# Altium schematic sheet IO_Buffer.SchDoc: WR_Cute_Carrier
size A4; Author: G.Kasprowicz; CompanyName: WUT ISE; DrawnBy: G.Kasprowicz; Organization: WUT ISE; Address1: PW ISE; Address2: Nowowiejska 15/19 00-665 Warsaw; Address3: gkasprow@gmail.com; DocumentNumber: 6; Revision: 2; SheetNumber: 6; SheetTotal: 7; ModifiedBy: -; CheckedDate: -; Title2: IO_Buffer; DivGrp: WUT ISE; Designer: G.Kasprowicz; ModifiedDate: -; ProjectName: Sensor Box
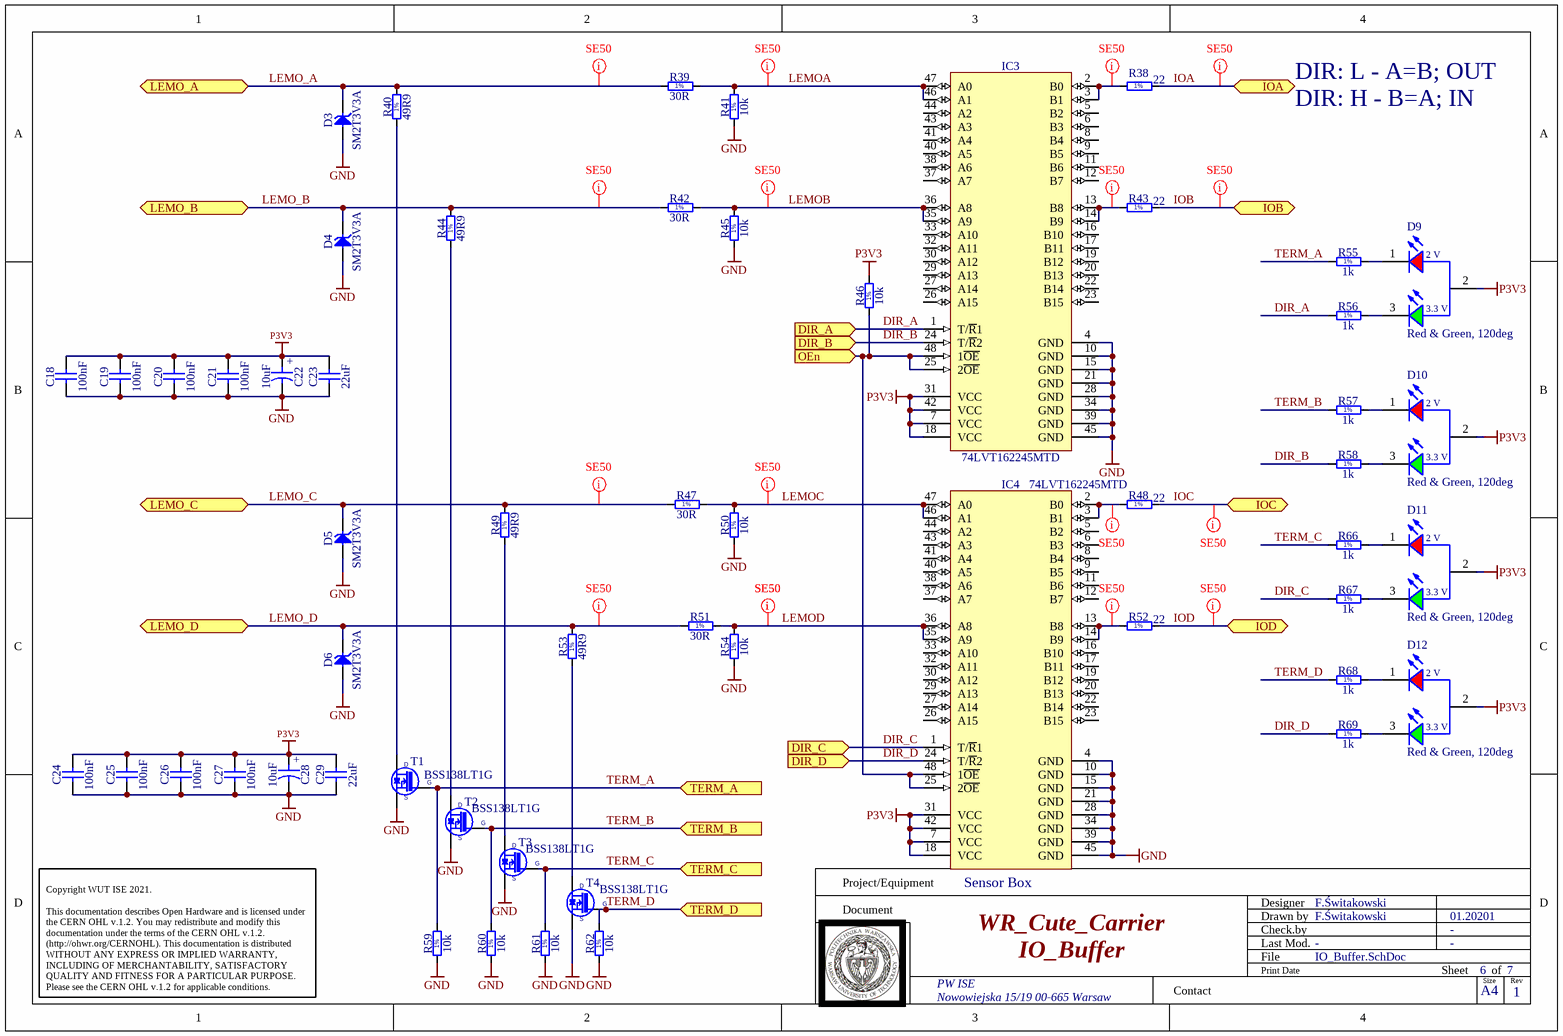
[diagram p0: IO_Buffer.SchDoc]

## Parts
C18  100nF  [CAPC1005X55N]
C19  100nF  [CAPC1005X55N]
C20  100nF  [CAPC1005X55N]
C21  100nF  [CAPC1005X55N]
C22  10uF  [CAPAE430X540N]
C23  22uF  [CAPC2012X135N]
C24  100nF  [CAPC1005X55N]
C25  100nF  [CAPC1005X55N]
C26  100nF  [CAPC1005X55N]
C27  100nF  [CAPC1005X55N]
C28  10uF  [CAPAE430X540N]
C29  22uF  [CAPC2012X135N]
D3  SM2T3V3A  [DO-216AA]
D4  SM2T3V3A  [DO-216AA]
D5  SM2T3V3A  [DO-216AA]
D6  SM2T3V3A  [DO-216AA]
D9  Red & Green, 120deg  [WL-SBSW_1204]
D10  Red & Green, 120deg  [WL-SBSW_1204]
D11  Red & Green, 120deg  [WL-SBSW_1204]
D12  Red & Green, 120deg  [WL-SBSW_1204]
IC3  74LVT162245MTD  [SOP50P810X120-48N]
IC4  74LVT162245MTD  [SOP50P810X120-48N]
R38  22  [RESC1005X40N]
R39  30R  [RESC3225X70N]
R40  49R9  [RESC3225X70N]
R41  10k  [RESC1005X40N]
R42  30R  [RESC3225X70N]
R43  22  [RESC1005X40N]
R44  49R9  [RESC3225X70N]
R45  10k  [RESC1005X40N]
R46  10k  [RESC1005X40N]
R47  30R  [RESC3225X70N]
R48  22  [RESC1005X40N]
R49  49R9  [RESC3225X70N]
R50  10k  [RESC1005X40N]
R51  30R  [RESC3225X70N]
R52  22  [RESC1005X40N]
R53  49R9  [RESC3225X70N]
R54  10k  [RESC1005X40N]
R55  1k  [RESC1005X40N]
R56  1k  [RESC1005X40N]
R57  1k  [RESC1005X40N]
R58  1k  [RESC1005X40N]
R59  10k  [RESC1005X40N]
R60  10k  [RESC1005X40N]
R61  10k  [RESC1005X40N]
R62  10k  [RESC1005X40N]
R66  1k  [RESC1005X40N]
R67  1k  [RESC1005X40N]
R68  1k  [RESC1005X40N]
R69  1k  [RESC1005X40N]
T1  BSS138LT1G  [SOT95P240X110-3N]
T2  BSS138LT1G  [SOT95P240X110-3N]
T3  BSS138LT1G  [SOT95P240X110-3N]
T4  BSS138LT1G  [SOT95P240X110-3N]

## Ports
DIR_A (in), DIR_B (in), DIR_C (in), DIR_D (in), IOA (bidir), IOB (bidir), IOC (bidir), IOD (bidir), LEMO_A (bidir), LEMO_B (bidir), LEMO_C (bidir), LEMO_D (bidir), OEn (in), TERM_A (in), TERM_B (in), TERM_C (in), TERM_D (in)

## Nets
GND: C18.1 C19.1 C20.1 C21.1 C22.2 C23.1 C24.1 C25.1 C26.1 C27.1 C28.2 C29.1 D3.2(A) D4.2(A) D5.2(A) D6.2(A) IC3.4(GND) IC3.10(GND) IC3.15(GND) IC3.21(GND) IC3.28(GND) IC3.34(GND) IC3.39(GND) IC3.45(GND) IC4.4(GND) IC4.10(GND) IC4.15(GND) IC4.21(GND) IC4.28(GND) IC4.34(GND) IC4.39(GND) IC4.45(GND) R41.1 R45.1 R50.1 R54.1 R59.1 R60.1 R61.1 R62.1 T1.2(S) T2.2(S) T3.2(S) T4.2(S)
P3V3: C18.2 C19.2 C20.2 C21.2 C22.1 C23.2 C24.2 C25.2 C26.2 C27.2 C28.1 C29.2 D9.2(A) D10.2(A) D11.2(A) D12.2(A) IC3.7(VCC) IC3.18(VCC) IC3.31(VCC) IC3.42(VCC) IC4.7(VCC) IC4.18(VCC) IC4.31(VCC) IC4.42(VCC) R46.2
DIR_A: IC3.1(T/~{R}1) R56.1 ; port DIR_A
DIR_B: IC3.24(T/~{R}2) R58.1 ; port DIR_B
DIR_C: IC4.1(T/~{R}1) R67.1 ; port DIR_C
DIR_D: IC4.24(T/~{R}2) R69.1 ; port DIR_D
IOA: R38.2 ; port IOA
IOB: R43.2 ; port IOB
IOC: R48.2 ; port IOC
IOD: R52.2 ; port IOD
LEMO_A: D3.1(C) R39.1 R40.2 ; port LEMO_A
LEMO_B: D4.1(C) R42.1 R44.2 ; port LEMO_B
LEMO_C: D5.1(C) R47.1 R49.2 ; port LEMO_C
LEMO_D: D6.1(C) R51.1 R53.2 ; port LEMO_D
LEMOA: IC3.46(A1) IC3.47(A0) R39.2 R41.2
LEMOB: IC3.35(A9) IC3.36(A8) R42.2 R45.2
LEMOC: IC4.46(A1) IC4.47(A0) R47.2 R50.2
LEMOD: IC4.35(A9) IC4.36(A8) R51.2 R54.2
OEn: IC3.25(2~{OE}) IC3.48(1~{OE}) IC4.25(2~{OE}) IC4.48(1~{OE}) R46.1 ; port OEn
TERM_A: R55.1 R59.2 T1.1(G) ; port TERM_A
TERM_B: R57.1 R60.2 T2.1(G) ; port TERM_B
TERM_C: R61.2 R66.1 T3.1(G) ; port TERM_C
TERM_D: R62.2 R68.1 T4.1(G) ; port TERM_D
NetD9_1: D9.1(K) R55.2
NetD9_3: D9.3(K) R56.2
NetD10_1: D10.1(K) R57.2
NetD10_3: D10.3(K) R58.2
NetD11_1: D11.1(K) R66.2
NetD11_3: D11.3(K) R67.2
NetD12_1: D12.1(K) R68.2
NetD12_3: D12.3(K) R69.2
NetIC3_2: IC3.2(B0) IC3.3(B1) R38.1
NetIC3_13: IC3.13(B8) IC3.14(B9) R43.1
NetIC4_2: IC4.2(B0) IC4.3(B1) R48.1
NetIC4_13: IC4.13(B8) IC4.14(B9) R52.1
NetR40_1: R40.1 T1.3(D)
NetR44_1: R44.1 T2.3(D)
NetR49_1: R49.1 T3.3(D)
NetR53_1: R53.1 T4.3(D)

Not connected (* = marked no-connect by the designer): IC3 5(B2) 6(B3) 8(B4) 9(B5) 11(B6) 12(B7) 16(B10) 17(B11) 19(B12) 20(B13) 22(B14) 23(B15) 26(A15) 27(A14) 29(A13) 30(A12) 32(A11) 33(A10) 37(A7) 38(A6) 40(A5) 41(A4) 43(A3) 44(A2); IC4 5(B2) 6(B3) 8(B4) 9(B5) 11(B6) 12(B7) 16(B10) 17(B11) 19(B12) 20(B13) 22(B14) 23(B15) 26(A15) 27(A14) 29(A13) 30(A12) 32(A11) 33(A10) 37(A7) 38(A6) 40(A5) 41(A4) 43(A3) 44(A2)

## Layout directives
net class SE50: IOA, IOB, IOC, IOD, LEMO_A, LEMO_B, LEMO_C, LEMO_D, LEMOA, LEMOB, LEMOC, LEMOD, NetIC3_2, NetIC3_13, NetIC4_2, NetIC4_13

## Notes on the sheet
- DIR: L - A=B; OUT
- DIR: H - B=A; IN
- Project/Equipment
- Document
- Designer
- Drawn by
- Check.by
- F.Świtakowski
- 01.20201
- PW ISE
- Contact
- File
- Last Mod.
- Print Date
- Sheet
- Size
- A4
- of
- 1
- Rev
- Copyright WUT ISE 2021.
  This documentation describes Open Hardware and is licensed under the CERN OHL v.1.2. You may redistribute and modify this documentation under the terms of the CERN OHL v.1.2. (http://ohwr.org/CERNOHL). This documentation is distributed WITHOUT ANY EXPRESS OR IMPLIED WARRANTY, INCLUDING OF MERCHANTABILITY, SATISFACTORY QUALITY AND FITNESS FOR A PARTICULAR PURPOSE. Please see the CERN OHL v.1.2 for applicable conditions.
- Nowowiejska 15/19 00-665 Warsaw
- (in symbol 155124RG73200) 2 V; 3.3 V
- (in symbol CAE430-540_10UF_16V_20%) +
- (in symbol R0402_1K_1%_0.0625W_100PPM) 1%
- (in symbol R0402_10K_1%_0.0625W_100PPM) 1%
- (in symbol R0402_22R_1%_0.0625W_100PPM) 1%
- (in symbol R1210_30R_5%_0.5W_200PPM) 1%
- (in symbol R1210_49R9_1%_0.5W_100PPM_VISHAY_CRCW) 1%

## Library data of the parts
C18-C21 C24-C27 = CC0402_100NF_16V_10%_X5R: Non-polarised capacitor; Part Description: SMD Multilayer Chip Ceramic Capacitor; Manufacturer: GENERIC; Manufacturer1 Part Number: GRM155R61C104KA88D; Voltage: 16V; TC: X5R; Tolerance: ±10%; Part Number: CC0402_100NF_16V_10%_X5R; Component Kind: Standard; Component Type: Standard; Pin Count: 2; Value: 100nF; Status: None; Manufacturer Part Number: CC0402_100NF_16V_10%_X5R; Case: 0402; Mounted: Yes; Socket: No; SMD: Yes; Sense: No; Manufacturer1 Example: MURATA; Manufacturer1 ComponentHeight: 0.55mm; HelpURL: \\cern.ch\dfs\Applications\Altium\Datasheets\CC0402_X5R_MURATA_GRM.pdf; Author: CERN DEM JLC; CreateDate: 10.12.2013; LatestRevisionDate: 10.12.2013
C22 C28 = CAE430-540_10UF_16V_20%: Polarised capacitor; Part Description: Aluminum Electrolytic SMT Capacitor; Manufacturer: PANASONIC; Manufacturer Part Number: EEEFK1C100AR; Voltage: 16V; Tolerance: ±20%; Part Number: CAE430-540_10UF_16V_20%; Component Kind: Standard; Component Type: Standard; Pin Count: 2; Value: 10uF; Status: Not Recommended; Case: B; Mounted: Yes; Socket: No; SMD: Yes; Sense: No; ComponentHeight: 5.8mm; HelpURL: \\cern.ch\dfs\Applications\Altium\Datasheets\CAE_PANASONIC_FK.pdf; Author: CERN DEM JLC; CreateDate: 03.12.2007; LatestRevisionDate: 05.11.2014
C23 C29 = CC0805_22UF_16V_10%_X5R: Non-polarised capacitor; Part Description: SMD Multilayer Chip Ceramic Capacitor; Manufacturer: GENERIC; Manufacturer1 Part Number: C2012X5R1C226KT; Voltage: 16V; TC: X5R; Tolerance: ±10%; Part Number: CC0805_22UF_16V_10%_X5R; Component Kind: Standard; Component Type: Standard; Pin Count: 2; Value: 22uF; Status: Preferred; Manufacturer Part Number: CC0805_22UF_16V_10%_X5R; Case: 0805; Mounted: Yes; Socket: No; SMD: Yes; Sense: No; Manufacturer1 Example: TDK; Manufacturer1 ComponentHeight: 1.35mm; HelpURL: \\cern.ch\dfs\Applications\Altium\Datasheets\CC0805_X5R_TDK_C.pdf; Author: CERN DEM JLC; CreateDate: 25.10.2012; LatestRevisionDate: 25.10.2012
D3-D6 = SM2T3V3A: Transient Voltage Suppressor Diode (Uni-Directional); Part Description: Low voltage Unidirectional Transil™ Diode; Manufacturer: ST MICROELECTRONICS; Voltage: 3V3; Power: 200W; PressFit: No; Bonding: No; Part Number: SM2T3V3A; Component Kind: Standard; Component Type: Standard; Device: SM2T3V3A; PackageDescription: DO-216-AA/SMB Molded Diode, Body 1.9x1.9mm, IPC Medium Density; Manufacturer Part Number: SM2T3V3A; Pin Count: 2; Case: DO-216AA; Mounted: Yes; Socket: No; SMD: Yes; Sense: No; ComponentHeight: 1.15mm; HelpURL: \\cern.ch\dfs\Applications\Altium\Datasheets\SM2T3V3A.pdf; Author: CERN DEM BR; CreateDate: 27.06.2019; LatestRevisionDate: 27.06.2019
D9-D12 = 155124RG73200: WL-SBSW SMT Bi-color Side View Waterclear, size 1204, Red & Green, 120deg; Luminous Intensity: 160mcd@Green, 60mcd@Red; Dominant Wavelength: 525nm@Green, 624nm@Red; Forward Voltage: 3.3V@Green, 2V@Red; Peak Wavelength: 520nm@Green, 632nm@Red; Chip Technology: AlInGaP + InGaN; ComponentLink1Description: Manufacturer; ComponentLink1URL: http://www.we-online.de; ComponentLink2Description: Datasheet; ComponentLink2URL: https://katalog.we-online.de/led/datasheet/155124RG73200.pdf; Emitting Color: Red & Green; Operating Temperature: -40 to +85degC; Mounting Technology: SMT; Part Number: 155124RG73200; Packaging: Tape and Reel; Published Date: October 2019; Publisher: Wurth Elektronik; Size: 1204; Viewing Angle: 120deg
IC3 IC4 = 74LVT162245MTD: Low Voltage 16-Bit Transceiver with 3-STATE Outputs and 25 Ohm Series Resistors in A Port Outputs; Manufacturer: FAIRCHILD SEMICONDUCTOR; PressFit: No; Bonding: No; Part Number: 74LVT162245MTD; Component Kind: Standard; Component Type: Standard; Device: 74LVT162245MTD; PackageDescription: SOP, 48-Leads, Body 12.6x6.2mm (max), Pitch 0.50mm, IPC Medium Density; Part Description: Low Voltage 16-Bit Transceiver with 3-STATE Outputs and 25 Ohm Series Resistors in A Port Outputs; Manufacturer Part Number: 74LVT162245MTD; Pin Count: 48; Case: TSSOP48; Mounted: Yes; Socket: No; SMD: Yes; Sense: No; ComponentHeight: 1.2mm; Author: CERN DEM MR; HelpURL: \\cern.ch\dfs\Applications\Altium\Datasheets\74LVT162245MTD.pdf; CreateDate: 06.12.2016; LatestRevisionDate: 06.12.2016
R38 R43 R48 R52 = R0402_22R_1%_0.0625W_100PPM: Resistor - 1%; Part Description: General Purpose Thick Film Chip Resistor; Manufacturer: GENERIC; Manufacturer1 Part Number: 232270672209L; TC: ±100ppm/°C; PressFit: No; Part Number: R0402_22R_1%_0.0625W_100PPM; Component Kind: Standard; Component Type: Standard; Pin Count: 2; Value: 22; Status: Not Recommended; Power: 0.0625W; Tolerance: ±1%; Manufacturer Part Number: R0402_22R_1%_0.0625W_100PPM; Case: 0402; Mounted: Yes; Sense: No; Socket: No; SMD: Yes; Manufacturer1 Example: YAGEO PHYCOMP; Manufacturer1 ComponentHeight: 0.4mm; HelpURL: \\cern.ch\dfs\Applications\Altium\Datasheets\R0402_Phycomp_RC0402.pdf; Author: CERN DEM JLC; CreateDate: 03.12.2007; LatestRevisionDate: 17.10.2012
R39 R42 R47 R51 = R1210_30R_5%_0.5W_200PPM: Resistor - 5%; Part Description: Thick Film Chip Resistor; Manufacturer: VISHAY; Manufacturer Part Number: CRCW121030R0JNEA; Power: 0.5W; TC: ±200ppm/°C; PressFit: No; Part Number: R1210_30R_5%_0.5W_200ppm; Component Kind: Standard; Component Type: Standard; Pin Count: 2; Value: 30R; Status: None; Tolerance: ±5%; Case: 1210; Mounted: Yes; Sense: No; Socket: No; SMD: Yes; HelpURL: \\cern.ch\dfs\Applications\Altium\Datasheets\R1210_VISHAY_CRCW1210.pdf; Author: CERN DEM JMW; CreateDate: 06.08.2014; LatestRevisionDate: 06.08.2014; ComponentHeight: 0.6mm
R40 R44 R49 R53 = R1210_49R9_1%_0.5W_100PPM_VISHAY_CRCW: Resistor - 1%; Part Description: Thick Film Chip Resistor; Manufacturer: VISHAY DRALORIC; Manufacturer Part Number: CRCW121049R9FKTA; Power: 0.5W; TC: ±100ppm/°C; Part Number: R1210_49R9_1%_0.5W_100PPM_VISHAY_CRCW; Component Kind: Standard; Component Type: Standard; Pin Count: 2; Value: 49R9; Status: None; Tolerance: ±1%; Case: 1210; Mounted: Yes; Sense: No; Socket: No; SMD: Yes; ComponentHeight: 0.6mm; HelpURL: \\cern.ch\dfs\Applications\Altium\Datasheets\R1210_VISHAY_CRCW1210.pdf; Author: CERN DEM JMW; CreateDate: 06.08.2014; LatestRevisionDate: 06.08.2014
R41 R45 R46 R50 R54 R59-R62 = R0402_10K_1%_0.0625W_100PPM: Resistor - 1%; Part Description: General Purpose Thick Film Chip Resistor; Manufacturer: GENERIC; Manufacturer1 Part Number: 232270671003L; TC: ±100ppm/°C; Part Number: R0402_10K_1%_0.0625W_100PPM; Component Kind: Standard; Component Type: Standard; Pin Count: 2; Value: 10k; Status: Not recommended; Power: 0.0625W; Tolerance: ±1%; Manufacturer Part Number: R0402_10K_1%_0.0625W_100PPM; Case: 0402; Mounted: Yes; Sense: No; Socket: No; SMD: Yes; Manufacturer1 Example: YAGEO PHYCOMP; Manufacturer1 ComponentHeight: 0.4mm; HelpURL: \\cern.ch\dfs\Applications\Altium\Datasheets\R0402_Phycomp_RC0402.pdf; Author: CERN DEM JLC; CreateDate: 03.12.2007; LatestRevisionDate: 17.10.2012
R55-R58 R66-R69 = R0402_1K_1%_0.0625W_100PPM: Resistor - 1%; Part Description: General Purpose Thick Film Chip Resistor; Manufacturer: GENERIC; Manufacturer1 Part Number: 232270671002L; TC: ±100ppm/°C; PressFit: No; Part Number: R0402_1K_1%_0.0625W_100PPM; Component Kind: Standard; Component Type: Standard; Pin Count: 2; Value: 1k; Status: Not Recommended; Power: 0.0625W; Tolerance: ±1%; Manufacturer Part Number: R0402_1K_1%_0.0625W_100PPM; Case: 0402; Mounted: Yes; Sense: No; Socket: No; SMD: Yes; Manufacturer1 Example: YAGEO PHYCOMP; Manufacturer1 ComponentHeight: 0.4mm; HelpURL: \\cern.ch\dfs\Applications\Altium\Datasheets\R0402_Phycomp_RC0402.pdf; Author: CERN DEM JLC; CreateDate: 03.12.2007; LatestRevisionDate: 17.10.2012
T1-T4 = BSS138LT1G: N-CHANNEL MOSFET WITH DIODE; Part Description: 50V 200mA N-Channel Enhancement Mode Field-Effect Transistor; Manufacturer: ON SEMICONDUCTOR; PressFit: No; Bonding: No; Part Number: BSS138LT1G; Component Kind: Standard; Component Type: Standard; Device: BSS138LT1G; PackageDescription: SOT23 3-Leads, Pitch 0.95mm - Body 1.4x3mm, IPC Medium Density; Manufacturer Part Number: BSS138LT1G; Pin Count: 3; Case: SOT23-3; Mounted: Yes; Socket: No; SMD: Yes; Sense: No; ComponentHeight: 1.11mm; HelpURL: \\cern.ch\dfs\Applications\Altium\Datasheets\BSS138LT1G.pdf; Author: CERN DEM JLC; CreateDate: 23.03.2009; LatestRevisionDate: 23.03.2009